# EAGLE design SUSTAINA-Audio-Board (EAGLE 9.6.2)
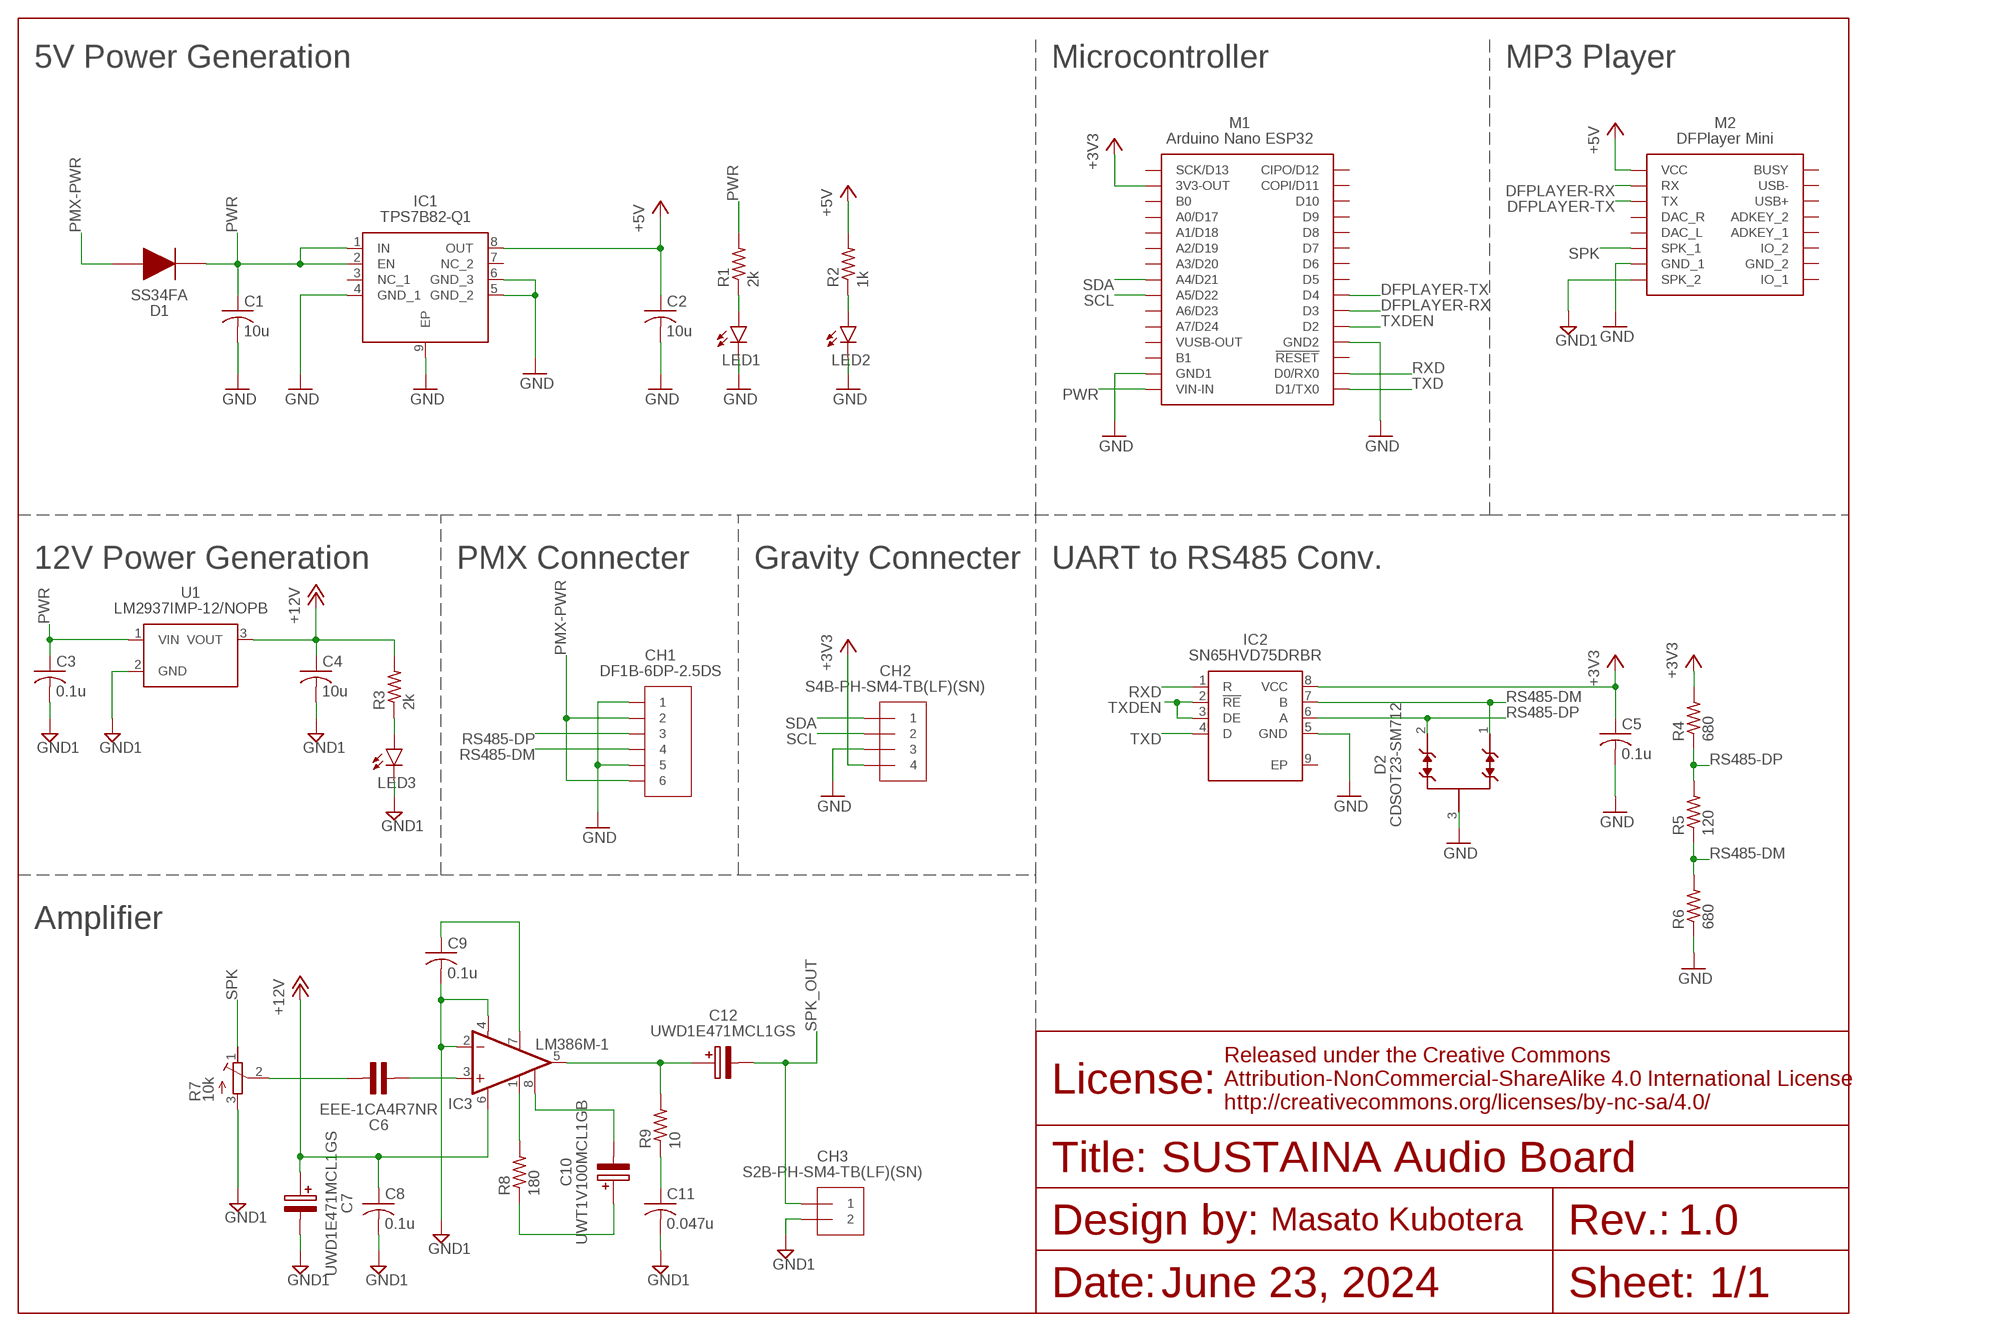
[diagram p0: schematic, sheet 1]

## Parts
C1  10u  C-USC0603  [C0603]
C2  10u  C-USC0603  [C0603]
C3  0.1u  C-USC0603  [C0603]
C4  10u  C-USC0603  [C0603]
C5  0.1u  C-USC0603  [C0603]
C6  EEE-1CA4R7NR  [EEE-1CA4R7NR]
C7  UWD1E471MCL1GS  [UWD1E471MCL1GS]
C8  0.1u  C-USC0603  [C0603]
C9  0.1u  C-USC0603  [C0603]
C10  UWT1V100MCL1GB  [UWT1V100MCL1GB]
C11  0.047u  C-US050-055X075  [C050-055X075]
C12  UWD1E471MCL1GS  [UWD1E471MCL1GS]
CH1  DF1B-6DP-2.5DS  [DF1B-6DP-2.5DS]
CH2  S4B-PH-SM4-TB(LF)(SN)  [S4B-PH-SM4-TB(LF)(SN)]
CH3  S2B-PH-SM4-TB(LF)(SN)  [S2B-PH-SM4-TB(LF)(SN)]
D1  SS34FA  [SS34FA]
D2  CDSOT23-SM712  [SOT-23-3]
IC1  TPS7B82-Q1  [SOP65P490X110-9N]
IC2  SN65HVD75DRBR  [SON65P300X300X100-9N]
IC3  LM386M-1  [SO08]
LED1  LEDSML0603  [SML0603]
LED2  LEDSML0603  [SML0603]
LED3  LEDSML0603  [SML0603]
M1  NANO-ESP32  [NANO-ESP32]
M2  DFPLAYER_MINI  [DFPLAYER_MINI]
R1  2k  R-US_R0603  [R0603]
R2  1k  R-US_R0603  [R0603]
R3  2k  R-US_R0603  [R0603]
R4  680  R-US_R0603  [R0603]
R5  120  R-US_R0603  [R0603]
R6  680  R-US_R0603  [R0603]
R7  10k  R-TRIMM3006P  [RTRIM3006P]
R8  180  R-US_R0603  [R0603]
R9  10  R-US_R0603  [R0603]
U1  LM2937IMP-12NOPB  [SOT-223]

## Nets
+3V3 [power]: C5.1 CH2.4 IC2.8(VCC) M1.3V3-OUT R4.2
+5V [high-power]: C2.1 IC1.8(OUT) M2.VCC R2.2
+12V [high-power]: C4.1 C7.+ C8.1 IC3.6(VS) R3.2 U1.3(VOUT)
DFPLAYER-RX [signal]: M1.D3 M2.RX
DFPLAYER-TX [signal]: M1.D4 M2.TX
GND [power]: C1.2 C2.2 C5.2 CH1.1 CH1.5 CH2.3 D2.3 IC1.4(GND_1) IC1.5(GND_2) IC1.6(GND_3) IC1.9(EP) IC2.5(GND) LED1.C LED2.C M1.GND1 M1.GND2 M2.GND_1 R6.1
GND1 [high-power]: C3.2 C4.2 C7.- C8.2 C9.2 C11.2 CH3.2 IC3.2(-IN) IC3.4(GND) LED3.C M2.SPK2(SPK_2) R7.3(A) U1.2(GND)
LED-5V [low-power]: LED2.A R2.1
LED-12V [low-power]: LED3.A R3.1
LED-VIN [low-power]: LED1.A R1.1
LM386_1 [high-power]: IC3.1(GAIN) R8.2
LM386_1-8 [high-power]: C10.+ R8.1
LM386_3 [high-power]: C6.1 IC3.3(+IN)
LM386_3_ [high-power]: C6.2 R7.2(S)
LM386_7 [high-power]: C9.1 IC3.7(BYPASS)
LM386_8 [high-power]: C10.- IC3.8(GAIN)
PMX-PWR [high-power]: CH1.2 CH1.6 D1.2
PWR [high-power]: C1.1 C3.1 D1.1 IC1.1(IN) IC1.2(EN) M1.VIN-IN R1.2 U1.1(VIN)
RS485-DM [signal]: CH1.4 D2.1 IC2.7(B) R5.1 R6.2
RS485-DP [signal]: CH1.3 D2.2 IC2.6(A) R4.1 R5.2
RXD [signal]: IC2.1(R) M1.D0/RX0
SCL [signal]: CH2.2 M1.A5/D22
SDA [signal]: CH2.1 M1.A4/D21
SPK [high-power]: M2.SPK1(SPK_1) R7.1(E)
SPK_OUT [high-power]: C12.- CH3.1
SPK_OUT_ [high-power]: C12.+ IC3.5(OUT) R9.2
SPK_OUT__ [high-power]: C11.1 R9.1
TXD [signal]: IC2.4(D) M1.D1/TX0
TXDEN [signal]: IC2.2(!RE) IC2.3(DE) M1.D2
Unconnected: IC1.3(NC_1) IC1.7(NC_2) IC2.9(EP) M1.!RESET M1.A0/D17 M1.A1/D18 M1.A2/D19 M1.A3/D20 M1.A6/D23 M1.A7/D24 M1.B0 M1.B1 M1.CIPO/D12 M1.COPI/D11 M1.D5 M1.D6 M1.D7 M1.D8 M1.D9 M1.D10 M1.SCK/D13 M1.VUSB-OUT M2.ADKEY1(ADKEY_1) M2.ADKEY2(ADKEY_2) M2.BUSY M2.DAC_L M2.DAC_R M2.GND_2 M2.IO1(IO_1) M2.IO2(IO_2) M2.USB+ M2.USB-

## Notes on the sheet
- 5V Power Generation | Microcontroller | MP3 Player
- 12V Power Generation | PMX Connecter | Gravity Connecter | UART to RS485 Conv.
- Amplifier
- SUSTAINA Audio Board
- 1.0
- June 23, 2024 | 1/1

## Library data of the parts
C1-C5 C8 C9 C11 = rcl:C-US: CAPACITOR, American symbol; SPICEPREFIX: C
C6 = EEE-1CA4R7NR:EEE-1CA4R7NR
C7 C12 = UWD1E471MCL1GS:UWD1E471MCL1GS
C10 = UWT1V100MCL1GB:UWT1V100MCL1GB
CH1 = DF1B-6DP-2.5DS:DF1B-6DP-2.5DS
CH2 = JST-PH:S4B-PH-SM4-TB(LF)(SN)
CH3 = JST-PH:S2B-PH-SM4-TB(LF)(SN)
D1 = SS34FA:SS34FA
D2 = CDSOT23-SM712:CDSOT23-SM712
IC1 = TPS7B82-Q1:TPS7B82-Q1
IC2 = SN65HVD75DRBR:SN65HVD75DRBR
IC3 = linear:LM386?-*: Low Voltage Audio Power Amplifier Source: http://cache.national.com/ds/LM/LM386.pdf
LED1-LED3 = led:LED: LED OSRAM: - CHIPLED LG R971, LG N971, LY N971, LG Q971, LY Q971, LO R971, LY R971 LH N974, LH R974 LS Q976, LO Q976, LY Q976 LO Q996 - Hyper CHIPLED LW Q18S LB Q993, LB Q99A, LB R99A - SideLED LS A670, LO A670, LY A670, LG A670, LP A670 LB A673, LV A673, LT A673, LW A673 LH A674 LY A675 LS A676, LA A676, LO A676, LY A676, LW A676 LS A679, LY A679, LG A679 - Hyper Micro SIDELED® LS Y876, LA Y876, LO Y876, LY Y876 LT Y87S - SmartLED LW L88C, LW L88S LB L89C, LB L89S, LG L890 LS L89K, LO L89K, LY L89K LS L896, LA L896, LO L896, LY L896 - TOPLED LS T670, LO T670, LY T670, LG T670, LP T670 LSG T670, LSP T670, LSY T670, LOP T670, LYG T670 LG T671, LOG T671, LSG T671 LB T673, LV T673, LT T673, LW T673 LH T674 LS T676, LA T676, LO T676, LY T676, LB T676, LH T676, LSB T676, LW T676 LB T67C, LV T67C, LT T67C, LS T67K, LO T67K, LY T67K, LW E67C LS E67B, LA E67B, LO E67B, LY E67B, LB E67C, LV E67C, LT E67C LW T67C LS T679, LY T679, LG T679 LS T770, LO T770, LY T770, LG T770, LP T770 LB T773, LV T773, LT T773, LW T773 LH T774 LS E675, LA E675, LY E675, LS T675 LS T776, LA T776, LO T776, LY T776, LB T776 LHGB T686 LT T68C, LB T68C - Hyper Mini TOPLED® LB M676 - Mini TOPLED Santana® LG M470 LS M47K, LO M47K, LY M47K Source: http://www.osram.convergy.de LUXEON: - LUMILED® LXK2-PW12-R00, LXK2-PW12-S00, LXK2-PW14-U00, LXK2-PW14-V00 LXK2-PM12-R00, LXK2-PM12-S00, LXK2-PM14-U00 LXK2-PE12-Q00, LXK2-PE12-R00, LXK2-PE12-S00, LXK2-PE14-T00, LXK2-PE14-U00 LXK2-PB12-K00, LXK2-PB12-L00, LXK2-PB12-M00, LXK2-PB14-N00, LXK2-PB14-P00, LXK2-PB14-Q00 LXK2-PR12-L00, LXK2-PR12-M00, LXK2-PR14-Q00, LXK2-PR14-R00 LXK2-PD12-Q00, LXK2-PD12-R00, LXK2-PD12-S00 LXK2-PH12-R00, LXK2-PH12-S00 LXK2-PL12-P00, LXK2-PL12-Q00, LXK2-PL12-R00 Source: www.luxeon.com KINGBRIGHT: KA-3528ASYC Source: www.kingbright.com
M1 = Arduino:NANO-ESP32
M2 = DFPlayer_Mini:DFPLAYER_MINI
R1-R6 R8 R9 = rcl:R-US_: RESISTOR, American symbol; SPICEPREFIX: R
R7 = rcl:R-TRIMM: Trimm resistor; SPICEMODEL: X; SPICEPREFIXL: POT
U1 = LM2937IMP-12NOPB:LM2937IMP-12NOPB

## Net classes
1 signal: width 0.203 mm, clearance 0.127 mm
2 power: width 0.254 mm, clearance 0.127 mm
3 low-power: width 0.254 mm
4 high-power: width 0.508 mm

## Board
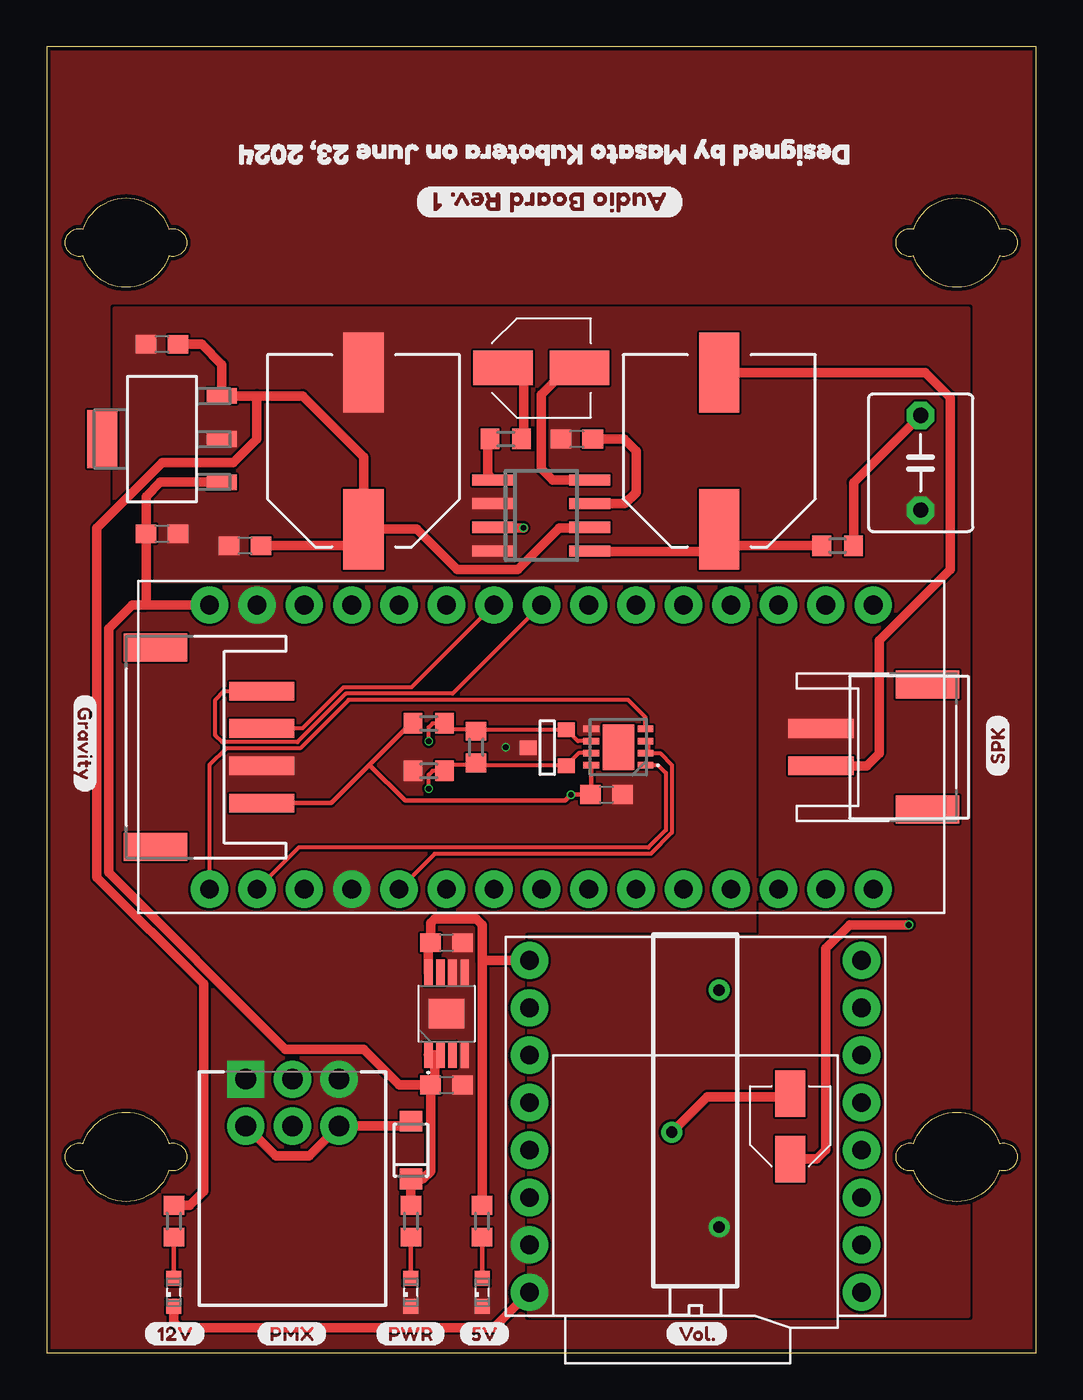
[diagram p1: board, top side]
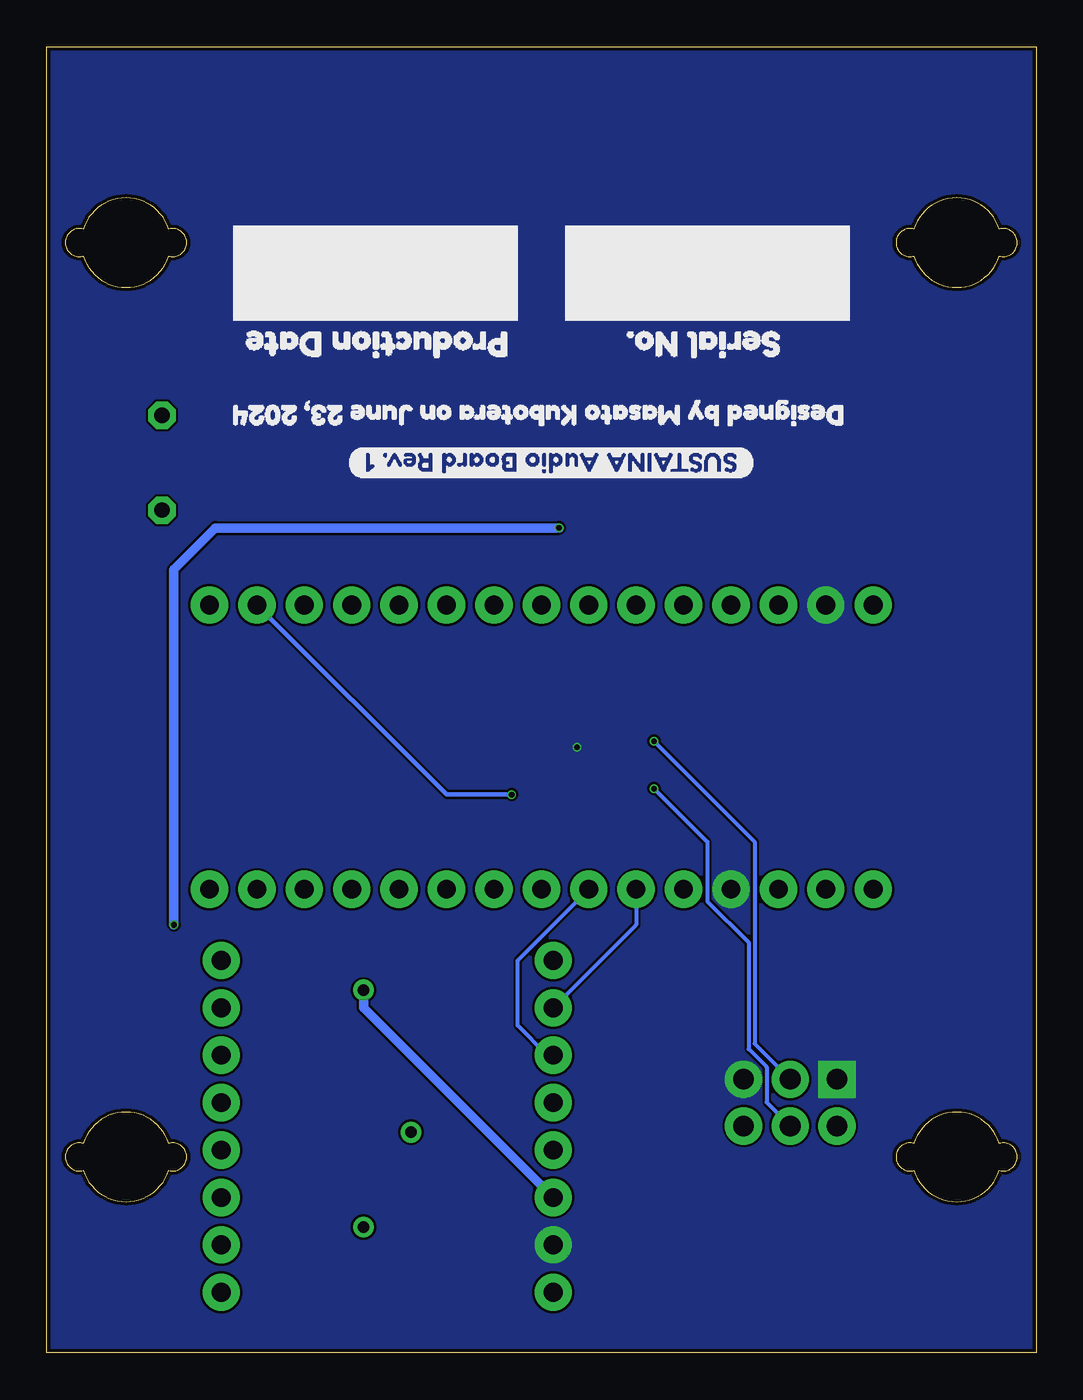
[diagram p2: board, bottom side, seen from below]

Size 53 x 70 mm. Coordinates in mm from the lower left corner, seen from the top.
Outline: 53,70 0,70 0,0 53,0 53,70
Outline: 6.54,60.22 arc-213 6.54,58.78 arc-145 1.96,58.78 arc-213 1.96,60.22 arc-145 6.54,60.22
Outline: 46.46,9.78 arc-213 46.46,11.22 arc-145 51.04,11.22 arc-213 51.04,9.78 arc-145 46.46,9.78
Outline: 46.46,58.78 arc-213 46.46,60.22 arc-145 51.04,60.22 arc-213 51.04,58.78 arc-145 46.46,58.78
Outline: 6.54,11.22 arc-213 6.54,9.78 arc-145 1.96,9.78 arc-213 1.96,11.22 arc-145 6.54,11.22
Copper layers (1*16): Top 0.035mm / dielectric 1.6mm / Bottom 0.035mm
Design rules "jlcpcb-2layers *": minimum track width 5mil, minimum drill 0.3mm, track to track 5mil, track to pad 5mil, pad to pad 5mil, via to via 5mil, smd to smd 5mil, copper to edge 0.2mm, drill to drill 6mil, minimum pad ring 10mil, minimum via ring 3mil, stop-mask expansion 4mil, vias tented up to drill 0.35mm, thermal gap 10mil

### Footprints (pad centres in the part's own frame; a part is rotated, then mirrored left to right if it is on the bottom)
C0603 = smd 1.1 x 1: 1 -0.85,0; 2 0.85,0
EEE-1CA4R7NR = smd 2.5 x 1.6: 1 -1.75,0; 2 1.75,0
UWD1E471MCL1GS = smd 4.3 x 2.15: + -4.2,0; - 4.2,0
UWT1V100MCL1GB = smd 3.2 x 1.85: + -2.05,0; - 2.05,0
C050-055X075 = drill 0.813 octagon: 1 -2.54,0; 2 2.54,0
DF1B-6DP-2.5DS = drill 1.1 pad 2 square: 1 -2.5,1.25 | drill 1.1 pad 2: 2 -2.5,-1.25; 3 0,1.25; 4 0,-1.25; 5 2.5,1.25; 6 2.5,-1.25
S4B-PH-SM4-TB(LF)(SN) = smd 1 x 3.5: 1 3,-7.25; 2 1,-7.25; 3 -1,-7.25; 4 -3,-7.25 | smd 1.5 x 3.4: S1 -5.35,-1.55; S2 5.35,-1.55
S2B-PH-SM4-TB(LF)(SN) = smd 1 x 3.5: 1 1,-7.25; 2 -1,-7.25 | smd 1.5 x 3.4: S1 -3.35,-1.55; S2 3.35,-1.55
SS34FA = smd 1.12 x 1.22: 1 -1.55,0; 2 1.55,0
SOT-23-3 = smd 0.787 x 0.889: 1 0.991,1.016; 2 -0.94,1.016; 3 0.025,-1.016
SOP65P490X110-9N = smd 1.4 x 0.45: 1 -2.2,0.975; 2 -2.2,0.325; 3 -2.2,-0.325; 4 -2.2,-0.975; 5 2.2,-0.975; 6 2.2,-0.325; 7 2.2,0.325; 8 2.2,0.975 | smd 1.57 x 1.89: 9 0,0
SON65P300X300X100-9N = smd 0.85 x 0.35: 1 -1.45,0.975; 2 -1.45,0.325; 3 -1.45,-0.325; 4 -1.45,-0.975; 5 1.45,-0.975; 6 1.45,-0.325; 7 1.45,0.325; 8 1.45,0.975 | smd 1.7 x 2.45: 9 0,0
SO08 = smd 0.6 x 2.2: 1 -1.905,-2.6; 2 -0.635,-2.6; 3 0.635,-2.6; 4 1.905,-2.6; 5 1.905,2.6; 6 0.635,2.6; 7 -0.635,2.6; 8 -1.905,2.6
SML0603 = smd 0.8 x 0.8: A 0.75,0; C -0.75,0
NANO-ESP32 = drill 1 pad 2: 3V3-OUT -7.62,15.24; !RESET 7.62,-12.7; A0/D17 -7.62,10.16; A1/D18 -7.62,7.62; A2/D19 -7.62,5.08; A3/D20 -7.62,2.54; A4/D21 -7.62,0; A5/D22 -7.62,-2.54; A6/D23 -7.62,-5.08; A7/D24 -7.62,-7.62; B0 -7.62,12.7; B1 -7.62,-12.7; CIPO/D12 7.62,17.78; COPI/D11 7.62,15.24; D0/RX0 7.62,-15.24; D1/TX0 7.62,-17.78; D2 7.62,-7.62; D3 7.62,-5.08; D4 7.62,-2.54; D5 7.62,0; D6 7.62,2.54; D7 7.62,5.08; D8 7.62,7.62; D9 7.62,10.16; D10 7.62,12.7; GND1 -7.62,-15.24; GND2 7.62,-10.16; SCK/D13 -7.62,17.78; VIN-IN -7.62,-17.78; VUSB-OUT -7.62,-10.16
DFPLAYER_MINI = drill 1 pad 2: ADKEY1 8.89,0; ADKEY2 8.89,2.54; BUSY 8.89,10.16; DAC_L -8.89,0; DAC_R -8.89,2.54; GND_1 -8.89,-5.08; GND_2 8.89,-5.08; IO1 8.89,-7.62; IO2 8.89,-2.54; RX -8.89,7.62; SPK1 -8.89,-2.54; SPK2 -8.89,-7.62; TX -8.89,5.08; USB+ 8.89,5.08; USB- 8.89,7.62; VCC -8.89,10.16
R0603 = smd 1 x 1.1: 1 -0.85,0; 2 0.85,0
RTRIM3006P = drill 0.61: 1 -7.62,1.27; 2 0,-1.27; 3 5.08,1.27
SOT-223 = smd 1.6 x 0.838: 1 -3.2,2.311; 2 -3.2,0; 3 -3.2,-2.311 | smd 1.6 x 3.099: 4 3.2,0

### Placement (x,y rotation side)
C1  21.42,14.36 0 top
C2  21.42,21.98 0 top
C3  6.18,43.89 0 top
C4  6.18,54.05 180 top
C5  29.99,29.92 0 top
C6  39.84,12.14 90 top
C7  16.98,48.34 90 top
C8  10.62,43.26 180 top
C9  28.41,48.97 180 top
C10  26.5,52.78 0 top
C11  46.82,47.7 270 top
C12  36.02,48.34 90 top
CH1  13.16,13.41 0 top
CH2  4.27,32.46 90 top
CH3  48.73,32.46 270 top
D1  19.52,10.87 90 top
D2  26.82,32.46 270 top
IC1  21.42,18.17 90 top
IC2  30.63,32.46 180 top
IC3  26.5,44.88 270 top
LED1  19.52,3.25 90 top
LED2  23.32,3.25 90 top
LED3  6.82,3.25 90 top
M1  26.5,32.46 270 top
M2  34.76,10.87 0 top
R1  19.52,7.06 90 top
R2  23.32,7.06 90 top
R3  6.82,7.06 90 top
R4  20.47,33.73 180 top
R5  23.01,32.46 90 top
R6  20.47,31.19 0 top
R7  34.76,11.82 270 top
R8  24.59,48.97 180 top
R9  42.38,43.26 180 top
U1  6.18,48.97 180 top
U$1  [GRAVITY-0.03]  2.05,35.32 270 top
U$2  [DESIGNED_BY_MASATO_KUBOTERA_ON_JUNE_23]  43.96,64.21 180 top
U$3  [12V-0.03]  5.23,1.03 0 top
U$4  [5V-0.03]  22.05,1.03 0 top
U$5  [PMX-0.03]  11.26,1.03 0 top
U$6  [PWR-0.03]  17.61,1.03 0 top
U$7  [VOL#-0.03]  33.17,1.03 0 top
U$8  [SPK-0.03]  50.95,30.87 90 top
U$9  [SUSTAINA_AUDIO_BOARD_REV#_1]  15.07,47.7 180 bottom
U$10  [AUDIO_BOARD_REV#_1]  34.12,61.67 180 top
U$11  [DESIGNED_BY_MASATO_KUBOTERA_ON_JUNE_23]  9.36,50.24 180 bottom
U$12  PRODUCTION_DATE0  [PRODUCTION_DATE0]  27.14,54.05 180 bottom
U$13  SERIAL_NO#0  [SERIAL_NO#0]  12.53,54.05 180 bottom

### Tracks (layer width: path | path; a pad name or v marks a point on that pad's centre or on a via)
+3V3  (via drill 0.3)
  Top 0.254: 29.04,31.51 IC2.8 | 17.29,31.51 15.24,29.46 CH2.4 | 17.29,31.51 19.52,33.73 R4.2 | v28.09,29.92 27.77,29.6 19.2,29.6 17.29,31.51 | IC2.8 29.5,31.48 | 28.86,30.2 C5.1 v28.09,29.92 | IC2.8 29.18,29.92 v28.09,29.92
  Bottom 0.254: M1.3V3-OUT 31.58,29.92 v28.09,29.92
+5V
  Top 0.508: IC1.8 20.45,21.98 C2.1 20.57,23.04 20.79,23.25 23.01,23.25 23.32,22.94 23.32,21.03 | M2.VCC 23.32,21.03 | 23.32,21.03 R2.2
+12V
  Top 0.508: C8.1 16.34,43.26 16.98,43.89 C7.+ | IC3.6 29.04,44.21 27.45,44.21 25.23,41.98 21.98,41.98 19.83,44.13 C7.+ | R3.2 7.66,7.91 8.4,8.65 8.4,19.76 2.69,25.48 2.69,44.21 6.18,47.7 9.99,47.7 11.26,48.97 11.26,51.28 | 9.67,51.19 U1.3 | 7.13,54.05 C4.1 8.3,54.05 9.38,52.97 U1.3 | 16.66,43.89 C7.+ | U1.3 11.26,51.28 | 11.26,51.28 13.71,51.28 16.98,48.02 C7.+
DFPLAYER-RX
  Bottom 0.203: M2.RX 21.42,22.94 M1.D3
DFPLAYER-TX
  Bottom 0.203: M1.D4 27.77,21.03 27.77,17.54 26.18,15.95 M2.TX
GND  (via drill 0.3)
  other vias: 24.59,32.46
  pour Top (rank 6, no thermals): -3.98,73.1 -3.98,-5.64 56.98,-5.64 56.98,73.1
  pour Bottom (no thermals): -6.52,75.64 -6.52,-8.18 59.52,-8.18 59.52,75.64
GND1
  Top 0.508: LED3.C 6.82,1.66 7.13,1.34 23.96,1.34 M2.SPK2
  pour Top (no thermals): 3.64,55.95 3.64,41.35 38.25,41.35 38.25,22.3 25.86,22.3 25.86,1.98 49.36,1.98 49.36,55.95
LED-5V
  Top 0.254: R2.1 LED2.A
LED-12V
  Top 0.254: R3.1 LED3.A
LED-VIN
  Top 0.254: R1.1 LED1.A
LM386_1
  Top 0.508: R8.2 23.64,48.97 23.64,47.06 IC3.1
LM386_1-8
  Top 0.508: C10.+ 25.55,52.78 25.55,48.97 R8.1
LM386_3  (via drill 0.3)
  Top 0.508: v25.55,44.21 23.96,44.21 IC3.3 | v46.19,22.94 43.01,22.94 41.74,21.66 41.74,10.87 41.26,10.39 C6.1
  Bottom 0.508: v25.55,44.21 43.96,44.21 46.19,41.98 v46.19,22.94
LM386_3_
  Top 0.508: R7.2 35.39,13.73 39.84,13.73 C6.2
LM386_7
  Top 0.508: 30.98,45.51 | 30.98,45.51 IC3.7 | C9.1 30.95,48.97 31.58,48.34 31.58,46.11 30.98,45.51
LM386_8
  Top 0.508: C10.- 27.91,52.78 26.5,51.36 26.5,47.38 27.1,46.78 IC3.8
PMX-PWR
  Top 0.508: D1.2 19.52,12.46 19.22,12.16 CH1.6 14.06,10.55 12.27,10.55 CH1.2
PWR
  Top 0.508: R1.2 D1.1 20.15,9.32 20.57,9.74 C1.1 | C1.1 20.79,14.58 20.79,15.97 | U1.1 6.09,46.66 5.33,45.9 C3.1 5.33,40.08 | M1.VIN-IN 5.33,40.08 | IC1.1 20.79,15.97 | 20.79,15.97 IC1.2 | C1.1 18.88,14.36 16.98,16.27 12.79,16.27 3.32,25.74 3.32,38.81 4.59,40.08 5.33,40.08
RS485-DM  (via drill 0.3)
  Top 0.203: IC2.7 28.5,32.13 D2.1 27.77,31.51 23.01,31.51 | 23.01,31.51 21.74,31.51 21.42,31.19 R6.2 20.68,31.19 20.47,30.98 v20.47,30.24 | 23.01,31.51 R5.1
  Bottom 0.203: v20.47,30.24 17.61,27.38 17.61,24.2 15.4,21.99 15.4,16.28 14.44,15.32 14.44,13.43 CH1.4
RS485-DP  (via drill 0.3)
  Top 0.203: IC2.6 29.04,32.78 28.46,32.78 D2.2 27.77,33.41 23.01,33.41 R5.2 22.91,33.41 21.63,33.41 R4.1 | 21.1,33.73 R4.1 | R4.1 20.68,33.73 20.47,33.52 v20.47,32.78
  Bottom 0.203: v20.47,32.78 15.07,27.38 15.07,16.57 CH1.3
RXD
  Top 0.203: IC2.1 32.76,31.48 33.17,31.08 33.17,28.02 32.23,27.07 13.49,27.07 M1.D0/RX0
SCL
  Top 0.203: M1.A5/D22 19.54,35.66 15.9,35.66 13.7,33.46 CH2.2
SDA
  Top 0.203: M1.A4/D21 21.75,35.33 16.04,35.33 13.44,32.73 9.4,32.73 9.04,33.09 9.04,35 9.5,35.46 CH2.1 11.89,35.46
SPK
  Bottom 0.508: M2.SPK1 36.02,18.49 R7.1
SPK_OUT
  Top 0.508: CH3.1 43.92,31.46 44.6,32.13 44.6,38.17 48.41,41.98 48.41,51.19 47.06,52.53 C12.-
SPK_OUT_
  Top 0.508: R9.2 36.66,43.26 36.02,43.89 C12.+ 36.02,43.57 35.39,42.94 29.36,42.94 IC3.5
SPK_OUT__
  Top 0.508: C11.1 43.23,46.64 R9.1
TXD
  Top 0.203: IC2.4 32.08,34.07 31.15,35 16.17,35 13.57,32.4 9.61,32.4 8.72,31.51 M1.D1/TX0
TXDEN
  Top 0.203: 32.22,32.14 32.22,32.78 IC2.3 | 32.53,32.14 32.22,32.14 | M1.D2 20.79,26.74 32.36,26.74 33.5,27.88 33.5,31.5 32.86,32.13 IC2.2 32.22,32.14